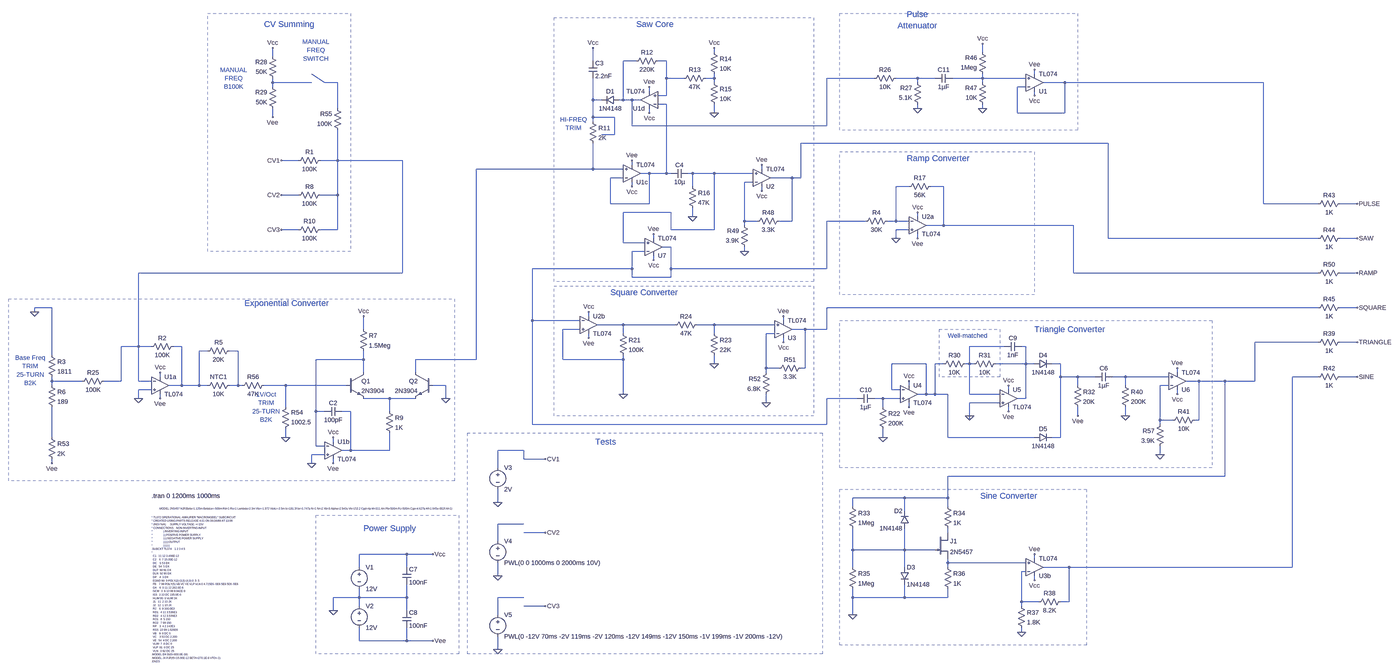
[diagram p0: schematic MDL-01 VCO.asc, whole sheet]
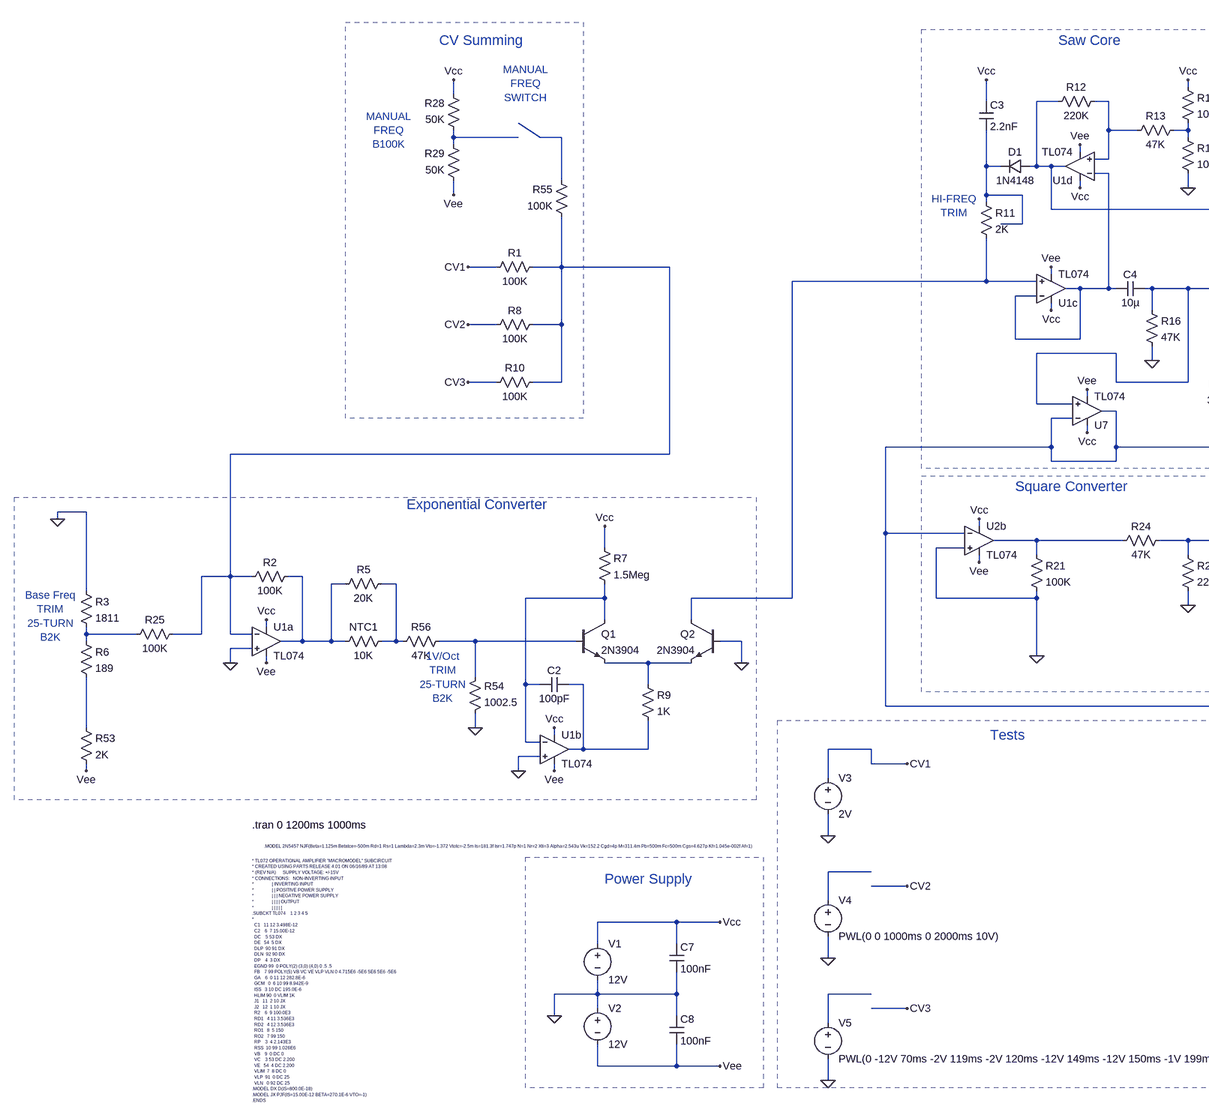
[diagram p1: schematic MDL-01 VCO.asc, part, row 1 of 1, column 1 of 2]
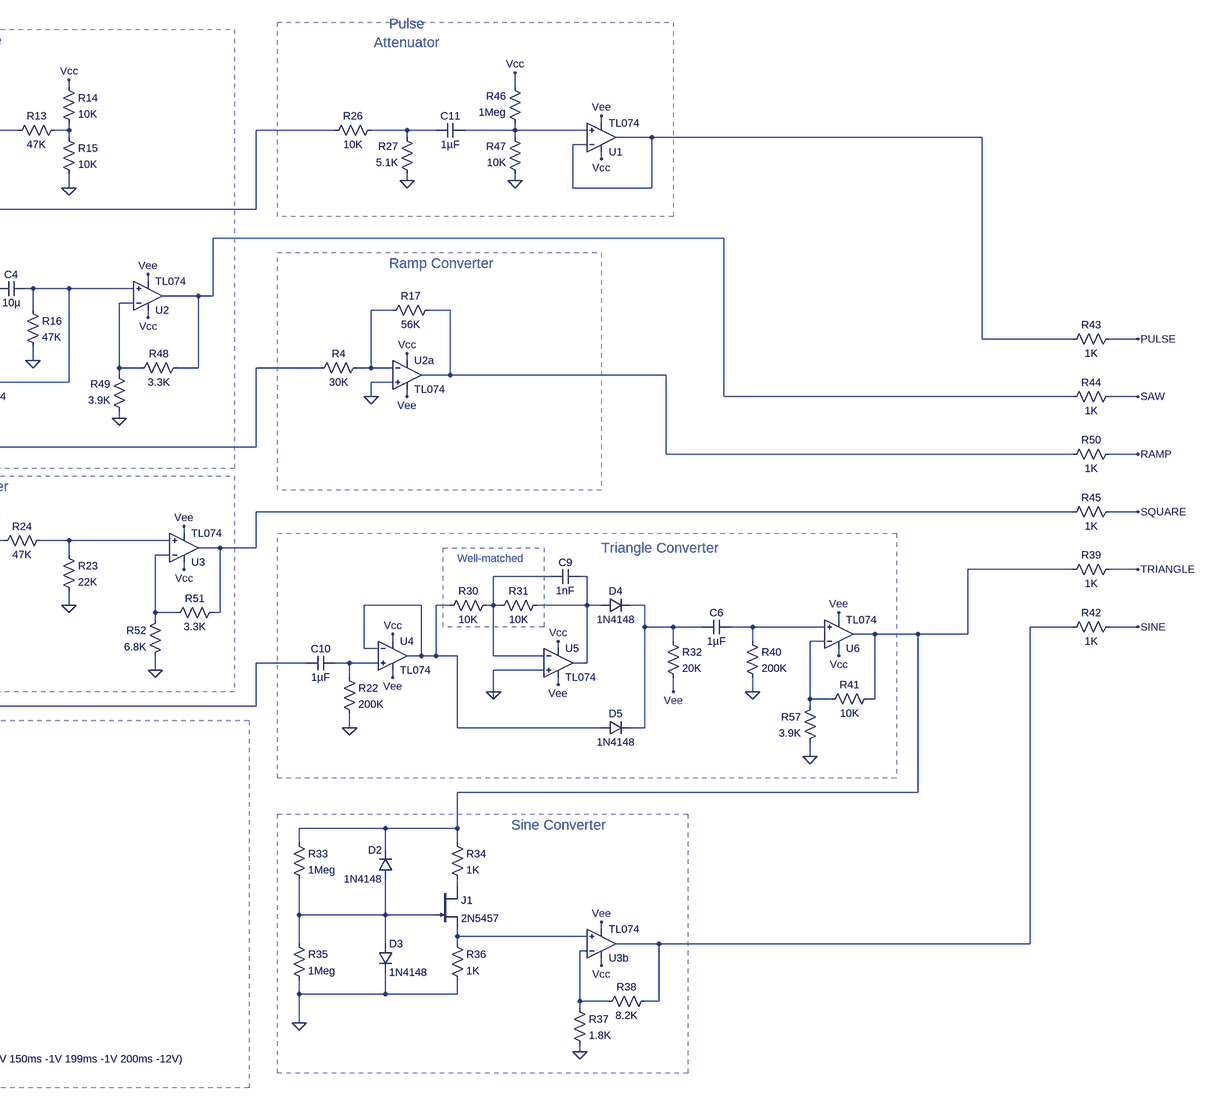
[diagram p2: schematic MDL-01 VCO.asc, part, row 1 of 1, column 2 of 2]
MDL-01 VCO.asc, the LTspice schematic file:
Version 4
SHEET 1 4808 3700
WIRE 2240 784 2240 768
WIRE 3232 784 3232 752
WIRE 608 800 608 768
WIRE 1792 816 1792 768
WIRE 1952 816 1904 816
WIRE 2064 816 2032 816
WIRE 3424 864 3424 848
WIRE 2064 880 2064 816
WIRE 2128 880 2064 880
WIRE 2240 880 2240 864
WIRE 2240 880 2208 880
WIRE 2832 880 2656 880
WIRE 2992 880 2912 880
WIRE 3056 880 2992 880
WIRE 3232 880 3232 864
WIRE 3232 880 3120 880
WIRE 3392 880 3232 880
WIRE 608 896 608 880
WIRE 752 896 608 896
WIRE 800 896 752 864
WIRE 848 896 800 896
WIRE 2240 896 2240 880
WIRE 2992 896 2992 880
WIRE 3232 896 3232 880
WIRE 3536 896 3456 896
WIRE 4272 896 3536 896
WIRE 608 912 608 896
WIRE 3392 912 3360 912
WIRE 2000 928 2000 912
WIRE 2064 944 2064 880
WIRE 2064 944 2032 944
WIRE 3424 944 3424 928
WIRE 1792 960 1792 880
WIRE 1824 960 1792 960
WIRE 1904 960 1904 816
WIRE 1904 960 1888 960
WIRE 1936 960 1904 960
WIRE 1968 960 1936 960
WIRE 2064 976 2032 976
WIRE 848 992 848 896
WIRE 2992 992 2992 976
WIRE 3232 992 3232 976
WIRE 2000 1008 2000 992
WIRE 2240 1008 2240 976
WIRE 3360 1008 3360 912
WIRE 3536 1008 3536 896
WIRE 3536 1008 3360 1008
WIRE 608 1024 608 992
WIRE 1792 1024 1792 960
WIRE 1872 1024 1792 1024
WIRE 1792 1040 1792 1024
WIRE 1936 1056 1936 960
WIRE 2656 1056 2656 880
WIRE 2656 1056 1936 1056
WIRE 1872 1088 1872 1024
WIRE 1872 1088 1824 1088
WIRE 3696 1120 2560 1120
WIRE 704 1184 640 1184
WIRE 848 1184 848 1072
WIRE 848 1184 784 1184
WIRE 1088 1184 848 1184
WIRE 1936 1200 1936 1184
WIRE 1792 1216 1792 1120
WIRE 1792 1216 1360 1216
WIRE 1904 1216 1792 1216
WIRE 2416 1216 2416 1200
WIRE 2000 1232 1968 1232
WIRE 2064 1232 2064 976
WIRE 2064 1232 2000 1232
WIRE 2080 1232 2064 1232
WIRE 2160 1232 2144 1232
WIRE 2240 1232 2160 1232
WIRE 2384 1232 2240 1232
WIRE 1904 1248 1856 1248
WIRE 2528 1248 2448 1248
WIRE 2560 1248 2560 1120
WIRE 2560 1248 2528 1248
WIRE 2384 1264 2352 1264
WIRE 1936 1280 1936 1264
WIRE 2160 1280 2160 1232
WIRE 2960 1280 2912 1280
WIRE 3088 1280 3040 1280
WIRE 2416 1296 2416 1280
WIRE 704 1312 640 1312
WIRE 848 1312 848 1184
WIRE 848 1312 784 1312
WIRE 1856 1344 1856 1248
WIRE 2000 1344 2000 1232
WIRE 2000 1344 1856 1344
WIRE 4272 1344 4272 896
WIRE 4528 1344 4272 1344
WIRE 4672 1344 4608 1344
WIRE 2080 1376 1904 1376
WIRE 2160 1392 2160 1360
WIRE 2992 1392 2992 1376
WIRE 2352 1408 2352 1264
WIRE 2400 1408 2352 1408
WIRE 2528 1408 2528 1248
WIRE 2528 1408 2480 1408
WIRE 2800 1408 2656 1408
WIRE 2912 1408 2912 1280
WIRE 2912 1408 2880 1408
WIRE 2960 1408 2912 1408
WIRE 2352 1424 2352 1408
WIRE 3088 1424 3088 1280
WIRE 3088 1424 3024 1424
WIRE 3568 1424 3088 1424
WIRE 704 1440 640 1440
WIRE 848 1440 848 1312
WIRE 848 1440 784 1440
WIRE 2080 1440 2080 1376
WIRE 2240 1440 2240 1232
WIRE 2240 1440 2080 1440
WIRE 2960 1440 2912 1440
WIRE 2016 1472 2016 1456
WIRE 2912 1472 2912 1440
WIRE 2992 1472 2992 1456
WIRE 3696 1472 3696 1120
WIRE 4528 1472 3696 1472
WIRE 4672 1472 4608 1472
WIRE 1904 1488 1904 1376
WIRE 1984 1488 1904 1488
WIRE 2080 1504 2048 1504
WIRE 1984 1520 1936 1520
WIRE 2352 1520 2352 1504
WIRE 2016 1552 2016 1536
WIRE 1936 1584 1936 1520
WIRE 1936 1584 1568 1584
WIRE 2080 1584 2080 1504
WIRE 2656 1584 2656 1408
WIRE 2656 1584 2080 1584
WIRE 1088 1600 1088 1184
WIRE 1088 1600 112 1600
WIRE 3568 1600 3568 1424
WIRE 4528 1600 3568 1600
WIRE 4672 1600 4608 1600
WIRE 1936 1616 1936 1584
WIRE 2080 1616 2080 1584
WIRE 2080 1616 1936 1616
WIRE -208 1728 -272 1728
WIRE 4528 1728 2656 1728
WIRE 4672 1728 4608 1728
WIRE -272 1744 -272 1728
WIRE 1776 1760 1776 1744
WIRE 1568 1776 1568 1584
WIRE 1744 1776 1568 1776
WIRE 2496 1776 2496 1760
WIRE 1904 1792 1808 1792
WIRE 2096 1792 1904 1792
WIRE 2240 1792 2176 1792
WIRE 2464 1792 2240 1792
WIRE 944 1808 944 1760
WIRE 1744 1808 1680 1808
WIRE 2576 1808 2528 1808
WIRE 2656 1808 2656 1728
WIRE 2656 1808 2576 1808
WIRE 1904 1824 1904 1792
WIRE 2240 1824 2240 1792
WIRE 2464 1824 2432 1824
WIRE 1776 1840 1776 1824
WIRE 2496 1856 2496 1840
WIRE 4528 1856 4240 1856
WIRE 4672 1856 4608 1856
WIRE 112 1872 112 1600
WIRE 112 1872 48 1872
WIRE 160 1872 112 1872
WIRE 272 1872 240 1872
WIRE 3312 1872 3184 1872
WIRE 3392 1872 3376 1872
WIRE 368 1888 336 1888
WIRE 480 1888 448 1888
WIRE -208 1904 -208 1728
WIRE 944 1920 944 1888
WIRE 944 1920 768 1920
WIRE 1360 1920 1360 1216
WIRE 1360 1920 1136 1920
WIRE 1680 1920 1680 1808
WIRE 1904 1920 1904 1904
WIRE 1904 1920 1680 1920
WIRE 2240 1936 2240 1904
WIRE 3024 1936 2896 1936
WIRE 3088 1936 3056 1936
WIRE 3184 1936 3184 1872
WIRE 3184 1936 3168 1936
WIRE 3200 1936 3184 1936
WIRE 3392 1936 3392 1872
WIRE 3392 1936 3280 1936
WIRE 3424 1936 3392 1936
WIRE 3520 1936 3488 1936
WIRE 2432 1952 2432 1824
WIRE 2480 1952 2432 1952
WIRE 2576 1952 2576 1808
WIRE 2576 1952 2560 1952
WIRE 944 1968 944 1920
WIRE 1136 1968 1136 1920
WIRE 2432 1968 2432 1952
WIRE 3952 1968 3952 1952
WIRE 192 1984 192 1968
WIRE 3520 1984 3520 1936
WIRE 3584 1984 3520 1984
WIRE 3648 1984 3584 1984
WIRE 3760 1984 3712 1984
WIRE 3920 1984 3760 1984
WIRE 4528 1984 4432 1984
WIRE 4672 1984 4608 1984
WIRE -208 2000 -208 1984
WIRE -96 2000 -208 2000
WIRE 48 2000 48 1872
WIRE 48 2000 -16 2000
WIRE 112 2000 112 1872
WIRE 160 2000 112 2000
WIRE 4032 2000 3984 2000
WIRE 4128 2000 4032 2000
WIRE 4240 2000 4240 1856
WIRE 4240 2000 4128 2000
WIRE -208 2016 -208 2000
WIRE 272 2016 272 1872
WIRE 272 2016 224 2016
WIRE 336 2016 336 1888
WIRE 336 2016 272 2016
WIRE 368 2016 336 2016
WIRE 480 2016 480 1888
WIRE 480 2016 448 2016
WIRE 496 2016 480 2016
WIRE 656 2016 576 2016
WIRE 880 2016 656 2016
WIRE 1248 2016 1200 2016
WIRE 2960 2016 2960 2000
WIRE 3584 2016 3584 1984
WIRE 3760 2016 3760 1984
WIRE 3920 2016 3888 2016
WIRE 160 2032 112 2032
WIRE 2896 2032 2896 1936
WIRE 2928 2032 2896 2032
WIRE 3328 2032 3328 2016
WIRE 1904 2048 1904 1920
WIRE 3024 2048 3024 1936
WIRE 3024 2048 2992 2048
WIRE 3056 2048 3056 1936
WIRE 3056 2048 3024 2048
WIRE 3104 2048 3056 2048
WIRE 3184 2048 3184 1936
WIRE 3296 2048 3184 2048
WIRE 3952 2048 3952 2032
WIRE 112 2064 112 2032
WIRE 192 2064 192 2048
WIRE 1040 2064 944 2064
WIRE 1136 2064 1040 2064
WIRE 1248 2064 1248 2016
WIRE 2768 2064 2656 2064
WIRE 2864 2064 2832 2064
WIRE 2928 2064 2864 2064
WIRE 3392 2064 3392 1936
WIRE 3392 2064 3360 2064
WIRE 2432 2080 2432 2048
WIRE 3296 2080 3184 2080
WIRE 656 2096 656 2016
WIRE 2864 2096 2864 2064
WIRE 2960 2096 2960 2080
WIRE 768 2112 768 1920
WIRE 800 2112 768 2112
WIRE 896 2112 864 2112
WIRE 1040 2112 1040 2064
WIRE 3328 2112 3328 2096
WIRE 3184 2128 3184 2080
WIRE 3584 2128 3584 2096
WIRE 3760 2128 3760 2096
WIRE 3184 2144 3184 2128
WIRE 3888 2144 3888 2016
WIRE 3936 2144 3888 2144
WIRE 4032 2144 4032 2000
WIRE 4032 2144 4016 2144
WIRE 1568 2160 1568 1776
WIRE 2656 2160 2656 2064
WIRE 2656 2160 1568 2160
WIRE 3888 2160 3888 2144
WIRE -208 2208 -208 2096
WIRE 656 2208 656 2176
WIRE 2864 2208 2864 2176
WIRE 3104 2208 3104 2048
WIRE 3424 2208 3104 2208
WIRE 3520 2208 3520 1984
WIRE 3520 2208 3488 2208
WIRE 832 2224 832 2208
WIRE 768 2240 768 2112
WIRE 800 2240 768 2240
WIRE 896 2256 896 2112
WIRE 896 2256 864 2256
WIRE 1040 2256 1040 2192
WIRE 1040 2256 896 2256
WIRE 1536 2256 1440 2256
WIRE 800 2272 752 2272
WIRE 3888 2272 3888 2240
WIRE 1536 2288 1536 2256
WIRE 1616 2288 1536 2288
WIRE -208 2304 -208 2288
WIRE 752 2304 752 2272
WIRE 832 2304 832 2288
WIRE 1440 2320 1440 2256
WIRE 4128 2352 4128 2000
WIRE 4128 2352 3104 2352
WIRE 2944 2432 2752 2432
WIRE 3104 2432 3104 2352
WIRE 3104 2432 2944 2432
WIRE 1440 2448 1440 2400
WIRE 2752 2464 2752 2432
WIRE 3104 2464 3104 2432
WIRE 2944 2480 2944 2432
WIRE 1536 2528 1440 2528
WIRE 1616 2560 1536 2560
WIRE 3104 2560 3104 2544
WIRE 1440 2592 1440 2528
WIRE 2752 2624 2752 2544
WIRE 2944 2624 2944 2544
WIRE 2944 2624 2752 2624
WIRE 3056 2624 2944 2624
WIRE 1104 2640 928 2640
WIRE 1200 2640 1104 2640
WIRE 3424 2656 3424 2640
WIRE 3104 2672 3104 2656
WIRE 3392 2672 3104 2672
WIRE 928 2688 928 2640
WIRE 1104 2688 1104 2640
WIRE 2752 2688 2752 2624
WIRE 2944 2688 2944 2624
WIRE 3104 2688 3104 2672
WIRE 3552 2688 3456 2688
WIRE 4432 2688 4432 1984
WIRE 4432 2688 3552 2688
WIRE 3392 2704 3376 2704
WIRE 1440 2720 1440 2672
WIRE 3424 2736 3424 2720
WIRE 928 2800 928 2768
WIRE 928 2800 832 2800
WIRE 1104 2800 1104 2752
WIRE 1104 2800 928 2800
WIRE 1536 2800 1440 2800
WIRE 2752 2800 2752 2768
WIRE 2944 2800 2944 2752
WIRE 2944 2800 2752 2800
WIRE 3104 2800 3104 2768
WIRE 3104 2800 2944 2800
WIRE 3376 2816 3376 2704
WIRE 3440 2816 3376 2816
WIRE 3552 2816 3552 2688
WIRE 3552 2816 3520 2816
WIRE 928 2832 928 2800
WIRE 1616 2832 1536 2832
WIRE 3376 2832 3376 2816
WIRE 832 2848 832 2800
WIRE 1104 2848 1104 2800
WIRE 1440 2864 1440 2800
WIRE 2752 2864 2752 2800
WIRE 3376 2928 3376 2912
WIRE 928 2960 928 2912
WIRE 1104 2960 1104 2912
WIRE 1104 2960 928 2960
WIRE 1200 2960 1104 2960
WIRE 1440 2992 1440 2944
FLAG 832 2848 0
FLAG 1200 2640 Vcc
FLAG 1200 2960 Vee
FLAG 1440 2448 0
FLAG 1616 2288 CV1
FLAG 640 1184 CV1
FLAG 112 2064 0
FLAG 192 1968 Vcc
FLAG 192 2064 Vee
FLAG 832 2208 Vcc
FLAG 832 2304 Vee
FLAG 752 2304 0
FLAG 1248 2064 0
FLAG 944 1760 Vcc
FLAG 2240 1008 0
FLAG 2000 1008 Vcc
FLAG 2000 912 Vee
FLAG 1936 1280 Vcc
FLAG 1936 1184 Vee
FLAG 2160 1392 0
FLAG 4672 1472 SAW
FLAG 1792 768 Vcc
FLAG 2240 768 Vcc
FLAG 640 1312 CV2
FLAG 640 1440 CV3
FLAG 4672 1344 PULSE
FLAG 2992 1376 Vcc
FLAG 2992 1472 Vee
FLAG 4672 1600 RAMP
FLAG 2912 1472 0
FLAG 1776 1744 Vcc
FLAG 1776 1840 Vee
FLAG 4672 1728 SQUARE
FLAG 1904 2048 0
FLAG 2240 1936 0
FLAG 2992 992 0
FLAG 608 768 Vcc
FLAG 608 1024 Vee
FLAG 4672 1856 TRIANGLE
FLAG 2752 2864 0
FLAG 4672 1984 SINE
FLAG 3424 2736 Vcc
FLAG 3424 2640 Vee
FLAG 3376 2928 0
FLAG 1440 2720 0
FLAG 1616 2560 CV2
FLAG 1440 2992 0
FLAG 1616 2832 CV3
FLAG 3232 752 Vcc
FLAG 3424 848 Vee
FLAG 2416 1200 Vee
FLAG 3424 944 Vcc
FLAG 2416 1296 Vcc
FLAG 3232 992 0
FLAG 2352 1520 0
FLAG 2496 1760 Vee
FLAG 2496 1856 Vcc
FLAG 2432 2080 0
FLAG -208 2304 Vee
FLAG -272 1744 0
FLAG 656 2208 0
FLAG 2960 2000 Vcc
FLAG 2960 2096 Vee
FLAG 2864 2208 0
FLAG 3328 2016 Vcc
FLAG 3328 2112 Vee
FLAG 3184 2128 0
FLAG 3760 2128 0
FLAG 3584 2128 Vee
FLAG 3952 1952 Vee
FLAG 3952 2048 Vcc
FLAG 3888 2272 0
FLAG 2016 1552 Vcc
FLAG 2016 1456 Vee
SYMBOL voltage 928 2672 R0
WINDOW 123 0 0 Left 0
WINDOW 39 0 0 Left 0
SYMATTR InstName V1
SYMATTR Value 12V
SYMBOL voltage 928 2816 R0
WINDOW 123 0 0 Left 0
WINDOW 39 0 0 Left 0
SYMATTR InstName V2
SYMATTR Value 12V
SYMBOL voltage 1440 2304 R0
WINDOW 123 0 0 Left 0
WINDOW 39 0 0 Left 0
SYMATTR InstName V3
SYMATTR Value 2V
SYMBOL res 800 1168 R90
WINDOW 0 0 56 VBottom 2
WINDOW 3 32 56 VTop 2
SYMATTR InstName R1
SYMATTR Value 100K
SYMBOL res 256 1856 R90
WINDOW 0 0 56 VBottom 2
WINDOW 3 32 56 VTop 2
SYMATTR InstName R2
SYMATTR Value 100K
SYMBOL res 464 2000 R90
WINDOW 0 0 56 VBottom 2
WINDOW 3 32 56 VTop 2
SYMATTR InstName NTC1
SYMATTR Value 10K
SYMBOL res 464 1872 R90
WINDOW 0 0 56 VBottom 2
WINDOW 3 32 56 VTop 2
SYMATTR InstName R5
SYMATTR Value 20K
SYMBOL res -224 2000 R0
SYMATTR InstName R6
SYMATTR Value 189
SYMBOL npn 880 1968 R0
SYMATTR InstName Q1
SYMATTR Value 2N3904
SYMBOL npn 1200 1968 M0
SYMATTR InstName Q2
SYMATTR Value 2N3904
SYMBOL cap 864 2096 R90
WINDOW 0 0 32 VBottom 2
WINDOW 3 32 32 VTop 2
SYMATTR InstName C2
SYMATTR Value 100pF
SYMBOL res 928 1792 R0
SYMATTR InstName R7
SYMATTR Value 1.5Meg
SYMBOL res 1024 2096 R0
SYMATTR InstName R9
SYMATTR Value 1K
SYMBOL res 1776 1024 R0
SYMATTR InstName R11
SYMATTR Value 2K
SYMBOL diode 1888 944 R90
WINDOW 0 0 32 VBottom 2
WINDOW 3 32 32 VTop 2
SYMATTR InstName D1
SYMATTR Value 1N4148
SYMBOL cap 1776 816 R0
SYMATTR InstName C3
SYMATTR Value 2.2nF
SYMBOL res 2048 800 R90
WINDOW 0 0 56 VBottom 2
WINDOW 3 32 56 VTop 2
SYMATTR InstName R12
SYMATTR Value 220K
SYMBOL res 2224 864 R90
WINDOW 0 0 56 VBottom 2
WINDOW 3 32 56 VTop 2
SYMATTR InstName R13
SYMATTR Value 47K
SYMBOL res 2224 768 R0
SYMATTR InstName R14
SYMATTR Value 10K
SYMBOL res 2224 880 R0
SYMATTR InstName R15
SYMATTR Value 10K
SYMBOL cap 2080 1248 R270
WINDOW 0 32 32 VTop 2
WINDOW 3 0 32 VBottom 2
SYMATTR InstName C4
SYMATTR Value 10µ
SYMATTR Description Polarized Capacitor
SYMATTR Type polcap
SYMATTR SpiceLine V=25 Irms=8.06 Rser=0.00577565 Lser=0 mfg="KEMET" pn="C1210C106K3PAC" type="X5R"
SYMBOL res 2144 1264 R0
SYMATTR InstName R16
SYMATTR Value 47K
SYMBOL res 800 1296 R90
WINDOW 0 0 56 VBottom 2
WINDOW 3 32 56 VTop 2
SYMATTR InstName R8
SYMATTR Value 100K
SYMBOL res 800 1424 R90
WINDOW 0 0 56 VBottom 2
WINDOW 3 32 56 VTop 2
SYMATTR InstName R10
SYMATTR Value 100K
SYMBOL res 1888 1808 R0
SYMATTR InstName R21
SYMATTR Value 100K
SYMBOL res 2224 1808 R0
SYMATTR InstName R23
SYMATTR Value 22K
SYMBOL res 2192 1776 R90
WINDOW 0 0 56 VBottom 2
WINDOW 3 32 56 VTop 2
SYMATTR InstName R24
SYMATTR Value 47K
SYMBOL res 2928 864 R90
WINDOW 0 0 56 VBottom 2
WINDOW 3 32 56 VTop 2
SYMATTR InstName R26
SYMATTR Value 10K
SYMBOL res 3008 992 R180
WINDOW 0 36 76 Left 2
WINDOW 3 36 40 Left 2
SYMATTR InstName R27
SYMATTR Value 5.1K
SYMBOL res 624 896 R180
WINDOW 0 36 76 Left 2
WINDOW 3 36 40 Left 2
SYMATTR InstName R28
SYMATTR Value 50K
SYMBOL res 624 1008 R180
WINDOW 0 36 76 Left 2
WINDOW 3 36 40 Left 2
SYMATTR InstName R29
SYMATTR Value 50K
SYMBOL res 2736 2448 R0
SYMATTR InstName R33
SYMATTR Value 1Meg
SYMBOL res 3088 2448 R0
SYMATTR InstName R34
SYMATTR Value 1K
SYMBOL res 2736 2672 R0
SYMATTR InstName R35
SYMATTR Value 1Meg
SYMBOL res 3088 2672 R0
SYMATTR InstName R36
SYMATTR Value 1K
SYMBOL diode 2960 2544 R180
WINDOW 0 24 64 Left 2
WINDOW 3 24 0 Left 2
SYMATTR InstName D2
SYMATTR Value 1N4148
SYMBOL diode 2928 2688 R0
SYMATTR InstName D3
SYMATTR Value 1N4148
SYMBOL njf 3056 2560 R0
SYMATTR InstName J1
SYMATTR Value 2N5457
SYMBOL Opamps\\opamp2 192 1952 R0
SYMATTR InstName U1a
SYMATTR Value TL074
SYMBOL Opamps\\opamp2 832 2192 R0
SYMATTR InstName U1b
SYMATTR Value TL074
SYMBOL Opamps\\opamp2 1936 1296 M180
SYMATTR InstName U1c
SYMATTR Value TL074
SYMBOL Opamps\\opamp2 2000 1024 R180
SYMATTR InstName U1d
SYMATTR Value TL074
SYMBOL Opamps\\opamp2 2992 1360 R0
SYMATTR InstName U2a
SYMATTR Value TL074
SYMBOL Opamps\\opamp2 1776 1728 R0
SYMATTR InstName U2b
SYMATTR Value TL074
SYMBOL Opamps\\opamp2 3424 2752 M180
SYMATTR InstName U3b
SYMATTR Value TL074
SYMBOL voltage 1440 2576 R0
WINDOW 123 0 0 Left 0
WINDOW 39 0 0 Left 0
SYMATTR InstName V4
SYMATTR Value PWL(0 0 1000ms 0 2000ms 10V)
SYMBOL cap 1088 2688 R0
SYMATTR InstName C7
SYMATTR Value 100nF
SYMBOL cap 1088 2848 R0
SYMATTR InstName C8
SYMATTR Value 100nF
SYMBOL voltage 1440 2848 R0
WINDOW 123 0 0 Left 0
WINDOW 39 0 0 Left 0
SYMATTR InstName V5
SYMATTR Value PWL(0 -12V 70ms -2V 119ms -2V 120ms -12V 149ms -12V 150ms -1V 199ms -1V 200ms -12V)
SYMBOL Opamps\\opamp2 3424 960 M180
SYMATTR InstName U1
SYMATTR Value TL074
SYMBOL res 4624 1328 R90
WINDOW 0 0 56 VBottom 2
WINDOW 3 32 56 VTop 2
SYMATTR InstName R43
SYMATTR Value 1K
SYMBOL Opamps\\opamp2 2416 1312 M180
SYMATTR InstName U2
SYMATTR Value TL074
SYMBOL res 4624 1456 R90
WINDOW 0 0 56 VBottom 2
WINDOW 3 32 56 VTop 2
SYMATTR InstName R44
SYMATTR Value 1K
SYMBOL Opamps\\opamp2 2496 1872 M180
SYMATTR InstName U3
SYMATTR Value TL074
SYMBOL res 4624 1712 R90
WINDOW 0 0 56 VBottom 2
WINDOW 3 32 56 VTop 2
SYMATTR InstName R45
SYMATTR Value 1K
SYMBOL res 3248 880 R180
WINDOW 0 36 76 Left 2
WINDOW 3 36 40 Left 2
SYMATTR InstName R46
SYMATTR Value 1Meg
SYMBOL cap 3056 896 R270
WINDOW 0 32 32 VTop 2
WINDOW 3 0 32 VBottom 2
SYMATTR InstName C11
SYMATTR Value 1µF
SYMATTR Description Polarized Capacitor
SYMATTR Type polcap
SYMATTR SpiceLine V=50 Irms=0 Rser=0.008 Lser=0 mfg="TDK" pn="C3225X7RlHlO5M" type="X7R"
SYMBOL res 3248 992 R180
WINDOW 0 36 76 Left 2
WINDOW 3 36 40 Left 2
SYMATTR InstName R47
SYMATTR Value 10K
SYMBOL res 2496 1392 R90
WINDOW 0 0 56 VBottom 2
WINDOW 3 32 56 VTop 2
SYMATTR InstName R48
SYMATTR Value 3.3K
SYMBOL res 2368 1520 R180
WINDOW 0 36 76 Left 2
WINDOW 3 36 40 Left 2
SYMATTR InstName R49
SYMATTR Value 3.9K
SYMBOL res 4624 1584 R90
WINDOW 0 0 56 VBottom 2
WINDOW 3 32 56 VTop 2
SYMATTR InstName R50
SYMATTR Value 1K
SYMBOL res 2576 1936 R90
WINDOW 0 0 56 VBottom 2
WINDOW 3 32 56 VTop 2
SYMATTR InstName R51
SYMATTR Value 3.3K
SYMBOL res 2448 1952 M0
SYMATTR InstName R52
SYMATTR Value 6.8K
SYMBOL res 4624 1840 R90
WINDOW 0 0 56 VBottom 2
WINDOW 3 32 56 VTop 2
SYMATTR InstName R39
SYMATTR Value 1K
SYMBOL res 4624 1968 R90
WINDOW 0 0 56 VBottom 2
WINDOW 3 32 56 VTop 2
SYMATTR InstName R42
SYMATTR Value 1K
SYMBOL res 3360 2816 R0
SYMATTR InstName R37
SYMATTR Value 1.8K
SYMBOL res 3536 2800 R90
WINDOW 0 0 56 VBottom 2
WINDOW 3 32 56 VTop 2
SYMATTR InstName R38
SYMATTR Value 8.2K
SYMBOL cap 2768 2080 R270
WINDOW 0 32 32 VTop 2
WINDOW 3 0 32 VBottom 2
SYMATTR InstName C10
SYMATTR Value 1µF
SYMATTR Description Polarized Capacitor
SYMATTR Type polcap
SYMATTR SpiceLine V=50 Irms=0 Rser=0.008 Lser=0
SYMBOL res -224 1888 R0
SYMATTR InstName R3
SYMATTR Value 1811
SYMBOL res 592 2000 R90
WINDOW 0 0 56 VBottom 2
WINDOW 3 32 56 VTop 2
SYMATTR InstName R56
SYMATTR Value 47K
SYMBOL res -224 2192 R0
SYMATTR InstName R53
SYMATTR Value 2K
SYMBOL res 640 2192 M180
WINDOW 0 36 76 Left 2
WINDOW 3 36 40 Left 2
SYMATTR InstName R54
SYMATTR Value 1002.5
SYMBOL res 0 1984 R90
WINDOW 0 0 56 VBottom 2
WINDOW 3 32 56 VTop 2
SYMATTR InstName R25
SYMATTR Value 100K
SYMBOL res 864 1088 R180
WINDOW 0 36 76 Left 2
WINDOW 3 36 40 Left 2
SYMATTR InstName R55
SYMATTR Value 100K
SYMBOL Opamps\\opamp2 2960 1984 R0
SYMATTR InstName U4
SYMATTR Value TL074
SYMBOL res 2848 2080 R0
SYMATTR InstName R22
SYMATTR Value 200K
SYMBOL res 3184 1920 R90
WINDOW 0 0 56 VBottom 2
WINDOW 3 32 56 VTop 2
SYMATTR InstName R30
SYMATTR Value 10K
SYMBOL res 3296 1920 R90
WINDOW 0 0 56 VBottom 2
WINDOW 3 32 56 VTop 2
SYMATTR InstName R31
SYMATTR Value 10K
SYMBOL Opamps\\opamp2 3328 2000 R0
SYMATTR InstName U5
SYMATTR Value TL074
SYMBOL diode 3424 1952 R270
WINDOW 0 32 32 VTop 2
WINDOW 3 0 32 VBottom 2
SYMATTR InstName D4
SYMATTR Value 1N4148
SYMBOL diode 3424 2224 R270
WINDOW 0 32 32 VTop 2
WINDOW 3 0 32 VBottom 2
SYMATTR InstName D5
SYMATTR Value 1N4148
SYMBOL res 3568 2000 R0
SYMATTR InstName R32
SYMATTR Value 20K
SYMBOL cap 3648 2000 R270
WINDOW 0 32 32 VTop 2
WINDOW 3 0 32 VBottom 2
SYMATTR InstName C6
SYMATTR Value 1µF
SYMATTR Description Polarized Capacitor
SYMATTR Type polcap
SYMATTR SpiceLine V=50 Irms=0 Rser=0.008 Lser=0
SYMBOL res 3744 2000 R0
SYMATTR InstName R40
SYMATTR Value 200K
SYMBOL cap 3312 1888 R270
WINDOW 0 32 32 VTop 2
WINDOW 3 0 32 VBottom 2
SYMATTR InstName C9
SYMATTR Value 1nF
SYMATTR Description Polarized Capacitor
SYMATTR Type polcap
SYMATTR SpiceLine V=50 Irms=0 Rser=0.008 Lser=0
SYMBOL Opamps\\opamp2 3952 2064 M180
SYMATTR InstName U6
SYMATTR Value TL074
SYMBOL res 4032 2128 R90
WINDOW 0 0 56 VBottom 2
WINDOW 3 32 56 VTop 2
SYMATTR InstName R41
SYMATTR Value 10K
SYMBOL res 3904 2144 M0
SYMATTR InstName R57
SYMATTR Value 3.9K
SYMBOL Opamps\\opamp2 2016 1568 M180
SYMATTR InstName U7
SYMATTR Value TL074
SYMBOL res 2896 1392 R90
WINDOW 0 0 56 VBottom 2
WINDOW 3 32 56 VTop 2
SYMATTR InstName R4
SYMATTR Value 30K
SYMBOL res 3056 1264 R90
WINDOW 0 0 56 VBottom 2
WINDOW 3 32 56 VTop 2
SYMATTR InstName R17
SYMATTR Value 56K
TEXT 160 2424 Left 2 !.tran 0 1200ms 1000ms
TEXT -288 1960 Center 2 ;Base Freq\nTRIM\n25-TURN\nB2K
TEXT 1720 1048 Center 2 ;HI-FREQ\nTRIM
TEXT 464 880 Center 2 ;MANUAL\nFREQ\nB100K
TEXT 768 776 Center 2 ;MANUAL\nFREQ\nSWITCH
TEXT 728 2472 Center 0 !.MODEL 2N5457 NJF(Beta=1.125m Betatce=-500m Rd=1 Rs=1 Lambda=2.3m Vto=-1.372 Vtotc=-2.5m Is=181.3f Isr=1.747p N=1 Nr=2 Xti=3 Alpha=2.543u Vk=152.2 Cgd=4p M=311.4m Pb=500m Fc=500m Cgs=4.627p Kf=1.045e-002f Af=1)
TEXT 160 2504 Left 0 !* TL072 OPERATIONAL AMPLIFIER "MACROMODEL" SUBCIRCUIT\n* CREATED USING PARTS RELEASE 4.01 ON 06/16/89 AT 13:08\n* (REV N/A)      SUPPLY VOLTAGE: +/-15V\n* CONNECTIONS:   NON-INVERTING INPUT\n*                | INVERTING INPUT\n*                | | POSITIVE POWER SUPPLY\n*                | | | NEGATIVE POWER SUPPLY\n*                | | | | OUTPUT\n*                | | | | |\n.SUBCKT TL074    1 2 3 4 5\n*\n  C1   11 12 3.498E-12\n  C2    6  7 15.00E-12\n  DC    5 53 DX\n  DE   54  5 DX\n  DLP  90 91 DX\n  DLN  92 90 DX\n  DP    4  3 DX\n  EGND 99  0 POLY(2) (3,0) (4,0) 0 .5 .5\n  FB    7 99 POLY(5) VB VC VE VLP VLN 0 4.715E6 -5E6 5E6 5E6 -5E6\n  GA    6  0 11 12 282.8E-6\n  GCM   0  6 10 99 8.942E-9\n  ISS   3 10 DC 195.0E-6\n  HLIM 90  0 VLIM 1K\n  J1   11  2 10 JX\n  J2   12  1 10 JX\n  R2    6  9 100.0E3\n  RD1   4 11 3.536E3\n  RD2   4 12 3.536E3\n  RO1   8  5 150\n  RO2   7 99 150\n  RP    3  4 2.143E3\n  RSS  10 99 1.026E6\n  VB    9  0 DC 0\n  VC    3 53 DC 2.200\n  VE   54  4 DC 2.200\n  VLIM  7  8 DC 0\n  VLP  91  0 DC 25\n  VLN   0 92 DC 25\n.MODEL DX D(IS=800.0E-18)\n.MODEL JX PJF(IS=15.00E-12 BETA=270.1E-6 VTO=-1)\n.ENDS
TEXT 944 2544 Left 3 ;Power Supply
TEXT 576 680 Left 3 ;CV Summing
TEXT 504 1712 Left 3 ;Exponential Converter
TEXT 1952 680 Left 3 ;Saw Core
TEXT 2992 664 Center 3 ;Pulse\nAttenuator
TEXT 2952 1176 Left 3 ;Ramp Converter
TEXT 1856 1672 Left 3 ;Square Converter
TEXT 3424 1808 Left 3 ;Triangle Converter
TEXT 3224 2424 Left 3 ;Sine Converter
TEXT 1800 2224 Left 3 ;Tests
TEXT 584 2096 Center 2 ;1V/Oct\nTRIM\n25-TURN\nB2K
TEXT 3104 1832 Left 2 ;Well-matched
RECTANGLE Normal 1296 3008 768 2496 2
RECTANGLE Normal 896 1520 368 640 2
RECTANGLE Normal 1280 2368 -368 1696 2
RECTANGLE Normal 2608 1632 1648 656 2
RECTANGLE Normal 3584 1072 2704 640 2
RECTANGLE Normal 3424 1680 2704 1152 2
RECTANGLE Normal 2608 2128 1648 1648 2
RECTANGLE Normal 4080 2320 2704 1776 2
RECTANGLE Normal 3616 2976 2704 2400 2
RECTANGLE Normal 2640 3008 1328 2192 2
RECTANGLE Normal 3296 1984 3072 1808 2

The netlist it stands for:
* MDL-01 VCO.asc
V1 Vcc 0 12V
V2 0 Vee 12V
V3 CV1 0 2V
R1 N012 CV1 100K
R2 N024 N012 100K
R§NTC1 N027 N024 10K
R5 N027 N024 20K
R6 N033 N039 189
Q1 N028 N034 N036 0 2N3904
Q2 N013 0 N036 0 2N3904
C2 N038 N028 100pF
R7 Vcc N028 1.5Meg
R9 N036 N038 1K
R11 N009 N013 2K
D1 N001 N009 1N4148
C3 Vcc N009 2.2nF
R12 N002 N001 220K
R13 N003 N002 47K
R14 Vcc N003 10K
R15 N003 0 10K
C4 N010 N014 10µ V=25 Irms=8.06 Rser=0.00577565 Lser=0 mfg="KEMET" pn="C1210C106K3PAC" type="X5R"
R16 N014 0 47K
R8 N012 CV2 100K
R10 N012 CV3 100K
R21 N020 0 100K
R23 N021 0 22K
R24 N021 N020 47K
R26 N004 N001 10K
R27 0 N004 5.1K
R28 N006 Vcc 50K
R29 Vee N006 50K
R33 N023 N042 1Meg
R34 N023 N041 1K
R35 N042 0 1Meg
R36 N043 0 1K
D2 N042 N023 1N4148
D3 N042 0 1N4148
J1 N041 N042 N043 2N5457
XU1a 0 N012 Vcc Vee N024 TL074  ; pins In+ In- V+ V- OUT
XU1b 0 N028 Vcc Vee N038 TL074  ; pins In+ In- V+ V- OUT
XU1c N013 N010 Vcc Vee N010 TL074  ; pins In+ In- V+ V- OUT
XU1d N002 N010 Vcc Vee N001 TL074  ; pins In+ In- V+ V- OUT
XU2a 0 N016 Vcc Vee N017 TL074  ; pins In+ In- V+ V- OUT
XU2b 0 N018 Vcc Vee N020 TL074  ; pins In+ In- V+ V- OUT
XU3b N043 N044 Vcc Vee N032 TL074  ; pins In+ In- V+ V- OUT
V4 N040 0 PWL(0 0 1000ms 0 2000ms 10V)
C7 Vcc 0 100nF
C8 0 Vee 100nF
V5 N045 0 PWL(0 -12V 70ms -2V 119ms -2V 120ms -12V 149ms -12V 150ms -1V 199ms -1V 200ms -12V)
XU1 N005 N008 Vcc Vee N008 TL074  ; pins In+ In- V+ V- OUT
R43 PULSE N008 1K
XU2 N014 N015 Vcc Vee N011 TL074  ; pins In+ In- V+ V- OUT
R44 SAW N011 1K
XU3 N021 N022 Vcc Vee N019 TL074  ; pins In+ In- V+ V- OUT
R45 SQUARE N019 1K
R46 N005 Vcc 1Meg
C11 N004 N005 1µF V=50 Irms=0 Rser=0.008 Lser=0 mfg="TDK" pn="C3225X7RlHlO5M" type="X7R"
R47 0 N005 10K
R48 N011 N015 3.3K
R49 0 N015 3.9K
R50 RAMP N017 1K
R51 N019 N022 3.3K
R52 N022 0 6.8K
R39 TRIANGLE N023 1K
R42 SINE N032 1K
R37 N044 0 1.8K
R38 N032 N044 8.2K
C10 N018 N037 1µF V=50 Irms=0 Rser=0.008 Lser=0
R3 0 N033 1811
R56 N034 N027 47K
R53 N039 Vee 2K
R54 0 N034 1002.5
R25 N012 N033 100K
R55 N012 N007 100K
XU4 N037 N029 Vcc Vee N029 TL074  ; pins In+ In- V+ V- OUT
R22 N037 0 200K
R30 N025 N029 10K
R31 N026 N025 10K
XU5 0 N025 Vcc Vee N026 TL074  ; pins In+ In- V+ V- OUT
D4 N026 N030 1N4148
D5 N029 N030 1N4148
R32 N030 Vee 20K
C6 N030 N031 1µF V=50 Irms=0 Rser=0.008 Lser=0
R40 N031 0 200K
C9 N025 N026 1nF V=50 Irms=0 Rser=0.008 Lser=0
XU6 N031 N035 Vcc Vee N023 TL074  ; pins In+ In- V+ V- OUT
R41 N023 N035 10K
R57 N035 0 3.9K
XU7 N014 N018 Vcc Vee N018 TL074  ; pins In+ In- V+ V- OUT
R4 N016 N018 30K
R17 N017 N016 56K
.model D D
.lib standard.dio
.model NPN NPN
.model PNP PNP
.lib standard.bjt
.model NJF NJF
.model PJF PJF
.lib standard.jft
.tran 0 1200ms 1000ms
* Base Freq
* TRIM
* 25-TURN
* B2K
* HI-FREQ
* TRIM
* MANUAL
* FREQ
* B100K
* MANUAL
* FREQ
* SWITCH
.MODEL 2N5457 NJF(Beta=1.125m Betatce=-500m Rd=1 Rs=1 Lambda=2.3m Vto=-1.372 Vtotc=-2.5m Is=181.3f Isr=1.747p N=1 Nr=2 Xti=3 Alpha=2.543u Vk=152.2 Cgd=4p M=311.4m Pb=500m Fc=500m Cgs=4.627p Kf=1.045e-002f Af=1)
* TL072 OPERATIONAL AMPLIFIER "MACROMODEL" SUBCIRCUIT
* CREATED USING PARTS RELEASE 4.01 ON 06/16/89 AT 13:08
* (REV N/A)      SUPPLY VOLTAGE: +/-15V
* CONNECTIONS:   NON-INVERTING INPUT
*                | INVERTING INPUT
*                | | POSITIVE POWER SUPPLY
*                | | | NEGATIVE POWER SUPPLY
*                | | | | OUTPUT
*                | | | | |
.SUBCKT TL074    1 2 3 4 5
*
  C1   11 12 3.498E-12
  C2    6  7 15.00E-12
  DC    5 53 DX
  DE   54  5 DX
  DLP  90 91 DX
  DLN  92 90 DX
  DP    4  3 DX
  EGND 99  0 POLY(2) (3,0) (4,0) 0 .5 .5
  FB    7 99 POLY(5) VB VC VE VLP VLN 0 4.715E6 -5E6 5E6 5E6 -5E6
  GA    6  0 11 12 282.8E-6
  GCM   0  6 10 99 8.942E-9
  ISS   3 10 DC 195.0E-6
  HLIM 90  0 VLIM 1K
  J1   11  2 10 JX
  J2   12  1 10 JX
  R2    6  9 100.0E3
  RD1   4 11 3.536E3
  RD2   4 12 3.536E3
  RO1   8  5 150
  RO2   7 99 150
  RP    3  4 2.143E3
  RSS  10 99 1.026E6
  VB    9  0 DC 0
  VC    3 53 DC 2.200
  VE   54  4 DC 2.200
  VLIM  7  8 DC 0
  VLP  91  0 DC 25
  VLN   0 92 DC 25
.MODEL DX D(IS=800.0E-18)
.MODEL JX PJF(IS=15.00E-12 BETA=270.1E-6 VTO=-1)
.ENDS
* Power Supply
* CV Summing
* Exponential Converter
* Saw Core
* Pulse
* Attenuator
* Ramp Converter
* Square Converter
* Triangle Converter
* Sine Converter
* Tests
* 1V/Oct
* TRIM
* 25-TURN
* B2K
* Well-matched
.backanno
.end